# EAGLE design TLE2141-Q1 (EAGLE 8.3.2)
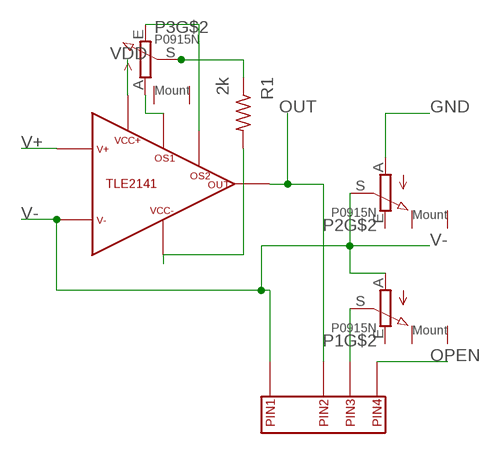
[diagram p0: schematic, sheet 1]

## Parts
P1  P0915N  [P0915N]
P2  P0915N  [P0915N]
P3  P0915N  [P0915N]
R1  2k  R-US_0207/15  [0207/15]
U$1  TLE2141-Q1  [TLE2141-Q1]
U$2  SP3T_SLIDE_SWITCH  [SP3T_SLIDE_SWITCH]

## Nets
GND: P2.A R1.2 U$1.VCC-(VSS)
N$1: P3.A U$1.OFFSETN1(OS1)
N$2: P3.E U$1.OFFSETN2(OS2)
N$5: P1.S U$2.PIN3
N$7: P3.S R1.1
OPEN: U$2.PIN4
OUT: U$1.OUT(VOUT) U$2.PIN2
V+: U$1.IN+(V+)
V-: P1.A P2.S U$1.IN-(V-) U$2.PIN1
VDD: U$1.VCC+(VDD)
Unconnected: P1.E P1.GND@1(GND) P1.GND@2(GND) P2.E P2.GND@1(GND) P2.GND@2(GND) P3.GND@1(GND) P3.GND@2(GND)

## Library data of the parts
P1-P3 = pie:P0915N
R1 = pie:R-US_: RESISTOR, American symbol; PIE-INT-REF-NUM: RESISTOR-GENERIC
U$1 = pie:TLE2141-Q1
U$2 = pie:SP3T_SLIDE_SWITCH: Single pole triple throw with slide switch

## Board
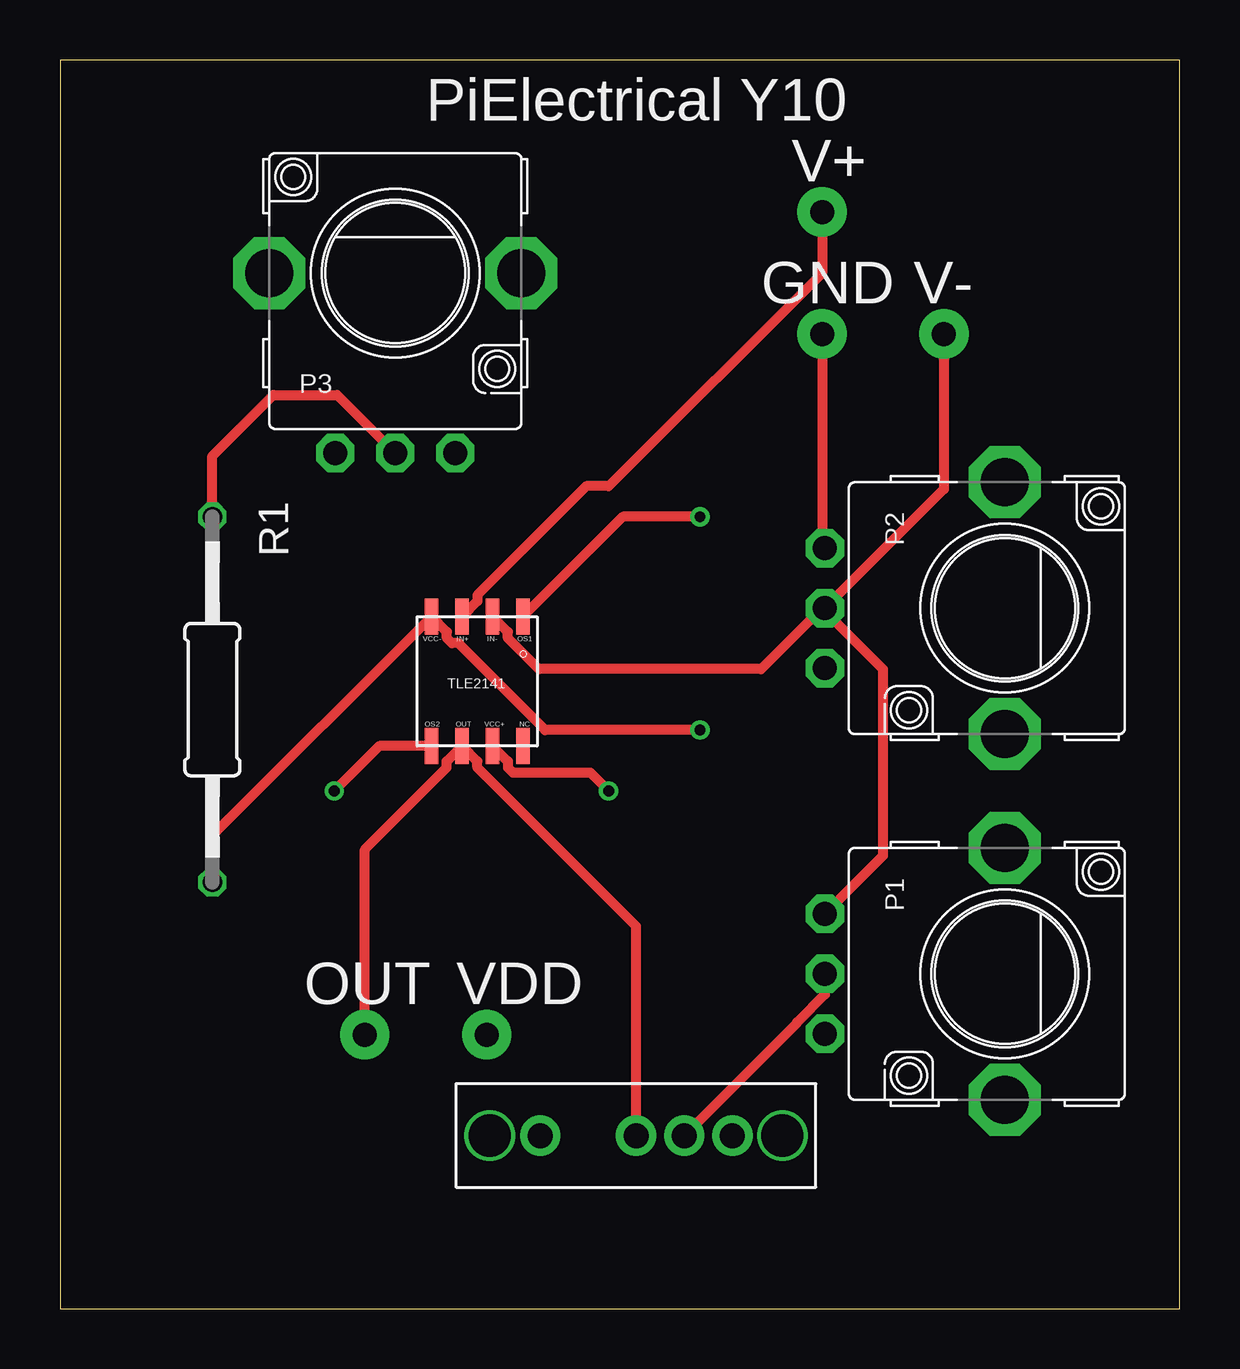
[diagram p1: board, top side]
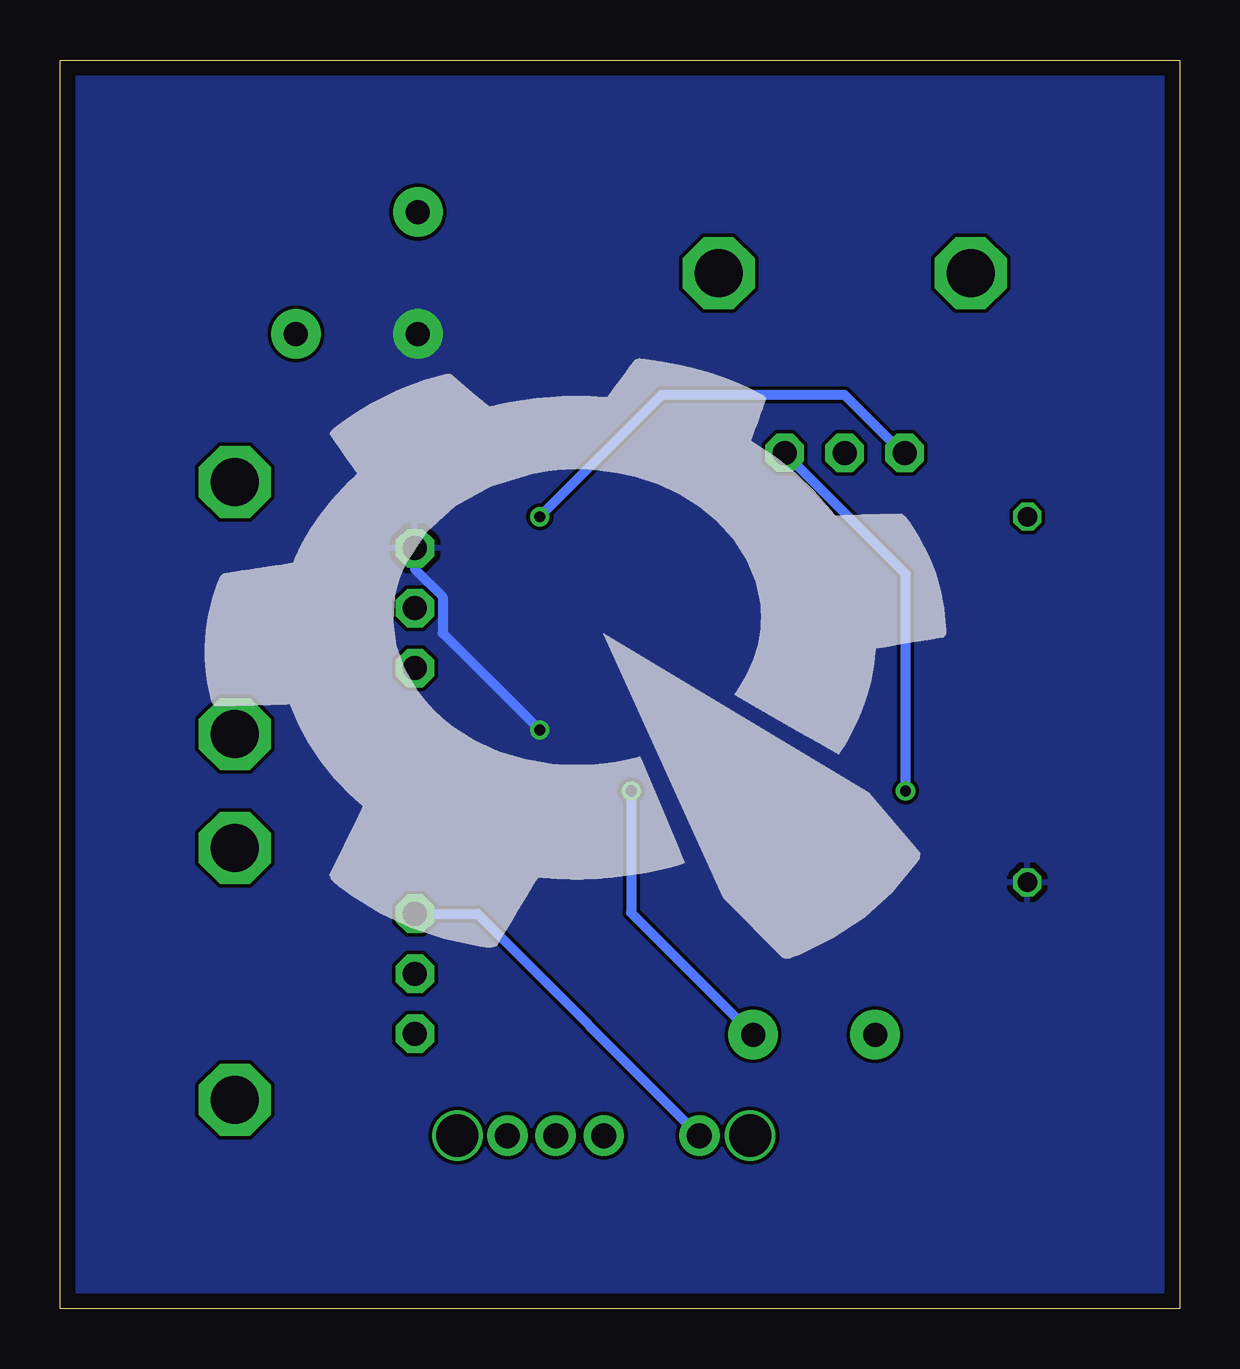
[diagram p2: board, bottom side, seen from below]

Size 46.66 x 52.06 mm. Coordinates in mm from the lower left corner, seen from the top.
Outline: 0,0 46.66,0 46.66,52.06 0,52.06 0,0
Copper layers (1*16): Top 2mil / dielectric 9mil / Bottom 2mil
Design rules "pie": minimum track width 6mil, minimum drill 15mil, track to track 6mil, track to pad 6mil, pad to pad 6mil, via to via 6mil, smd to smd 6mil, copper to edge 25mil, drill to drill 7mil, minimum pad ring 7mil, minimum via ring 7mil, stop-mask expansion 3mil, vias tented up to drill 21mil, thermal gap 10mil

### Footprints (pad centres in the part's own frame; a part is rotated, then mirrored left to right if it is on the bottom)
P0915N = drill 1 pad 1.6 octagon: A -2.5,-7.5; E 2.5,-7.5; S 0,-7.5 | drill 2 pad 3 octagon: GND@1 -5.25,0; GND@2 5.25,0
0207/15 = drill 0.813 octagon: 1 -7.62,0; 2 7.62,0
TLE2141-Q1 = smd 0.55 x 1.5: IN+ -13.73,6; IN- -12.46,6; NC -11.19,0.6; OFFSETN1 -11.19,6; OFFSETN2 -15,0.6; OUT -13.73,0.6; VCC+ -12.46,0.6; VCC- -15,6
SP3T_SLIDE_SWITCH = drill 1.753 pad 1.93: P$3 1.397,2.146; P$4 13.589,2.146 | drill 1.041 pad 1.676: PIN1 3.505,2.146; PIN2 7.493,2.146; PIN3 9.5,2.146; PIN4 11.506,2.146

### Placement (x,y rotation side)
P1  39.37,13.97 270 top
P2  39.37,29.21 270 top
P3  13.97,43.18 0 top
R1  6.35,25.4 270 top
U$1  30.48,22.86 0 top
U$2  16.51,5.08 0 top
U$3  [PIE-LOGO]  24.13,27.94 0 bottom

### Tracks (layer width: path | path; a pad name or v marks a point on that pad's centre or on a via)
GND  (via drill 0.45, 1 pad 2.06)
  Top 0.406: R1.2 6.35,19.73 U$1.VCC- 16.12,28.22 16.12,27.96 16.33,27.75 16.59,27.75 20.21,24.13 v26.67,24.13 | v31.75,40.64 31.75,31.83 P2.A
  Bottom 0.406: P2.A 31.87,30.84 30.71,29.69 30.71,28.17 v26.67,24.13
  pour Bottom: 0,52.07 0,0 46.99,0 46.99,52.07
N$1  (via drill 0.45)
  Top 0.406: v26.67,33.02 23.45,33.02 U$1.OFFSETN1
  Bottom 0.406: P3.A 11.55,35.68 13.97,38.1 21.59,38.1 v26.67,33.02
N$2  (via drill 0.45)
  Top 0.406: U$1.OFFSETN2 13.3,23.46 v11.43,21.59
  Bottom 0.406: v11.43,21.59 11.43,30.64 P3.E
N$5
  Top 0.406: U$2.PIN3 30.71,11.93 30.71,11.95 31.87,13.1 P1.S
N$7
  Top 0.406: R1.1 6.35,35.56 8.89,38.1 11.55,38.1 P3.S
OUT  (via drill 1 pad 2.06)
  Top 0.406: U$2.PIN2 24,15.95 17.39,22.56 17.39,22.82 U$1.OUT 16.11,22.82 16.11,22.56 12.7,19.15 v12.7,11.43
V+  (via drill 1 pad 2.06)
  Top 0.406: v31.75,45.72 31.75,43.18 22.86,34.29 21.92,34.29 17.39,29.76 17.39,29.5 U$1.IN+
V-  (via drill 1 pad 2.06)
  Top 0.406: v36.83,40.64 36.83,34.17 P2.S | P2.S 31.87,29.09 34.29,26.67 34.29,18.89 P1.A | P2.S 31.75,29.21 29.21,26.67 19.95,26.67 18.66,27.96 18.66,28.22 U$1.IN-
  Bottom 0.406: P1.A 29.26,16.47 U$2.PIN1
VDD  (via drill 0.45, 1 pad 2.06)
  Top 0.406: U$1.VCC+ 18.66,22.82 18.66,22.56 18.87,22.35 22.1,22.35 v22.86,21.59
  Bottom 0.406: v22.86,21.59 22.86,16.51 v17.78,11.43

### Text on the board
tPlace: PiElectrical Y10 | V+ | GND | V- | OUT | VDD